# EAGLE schematic Proto2 (EAGLE 8.5.1)
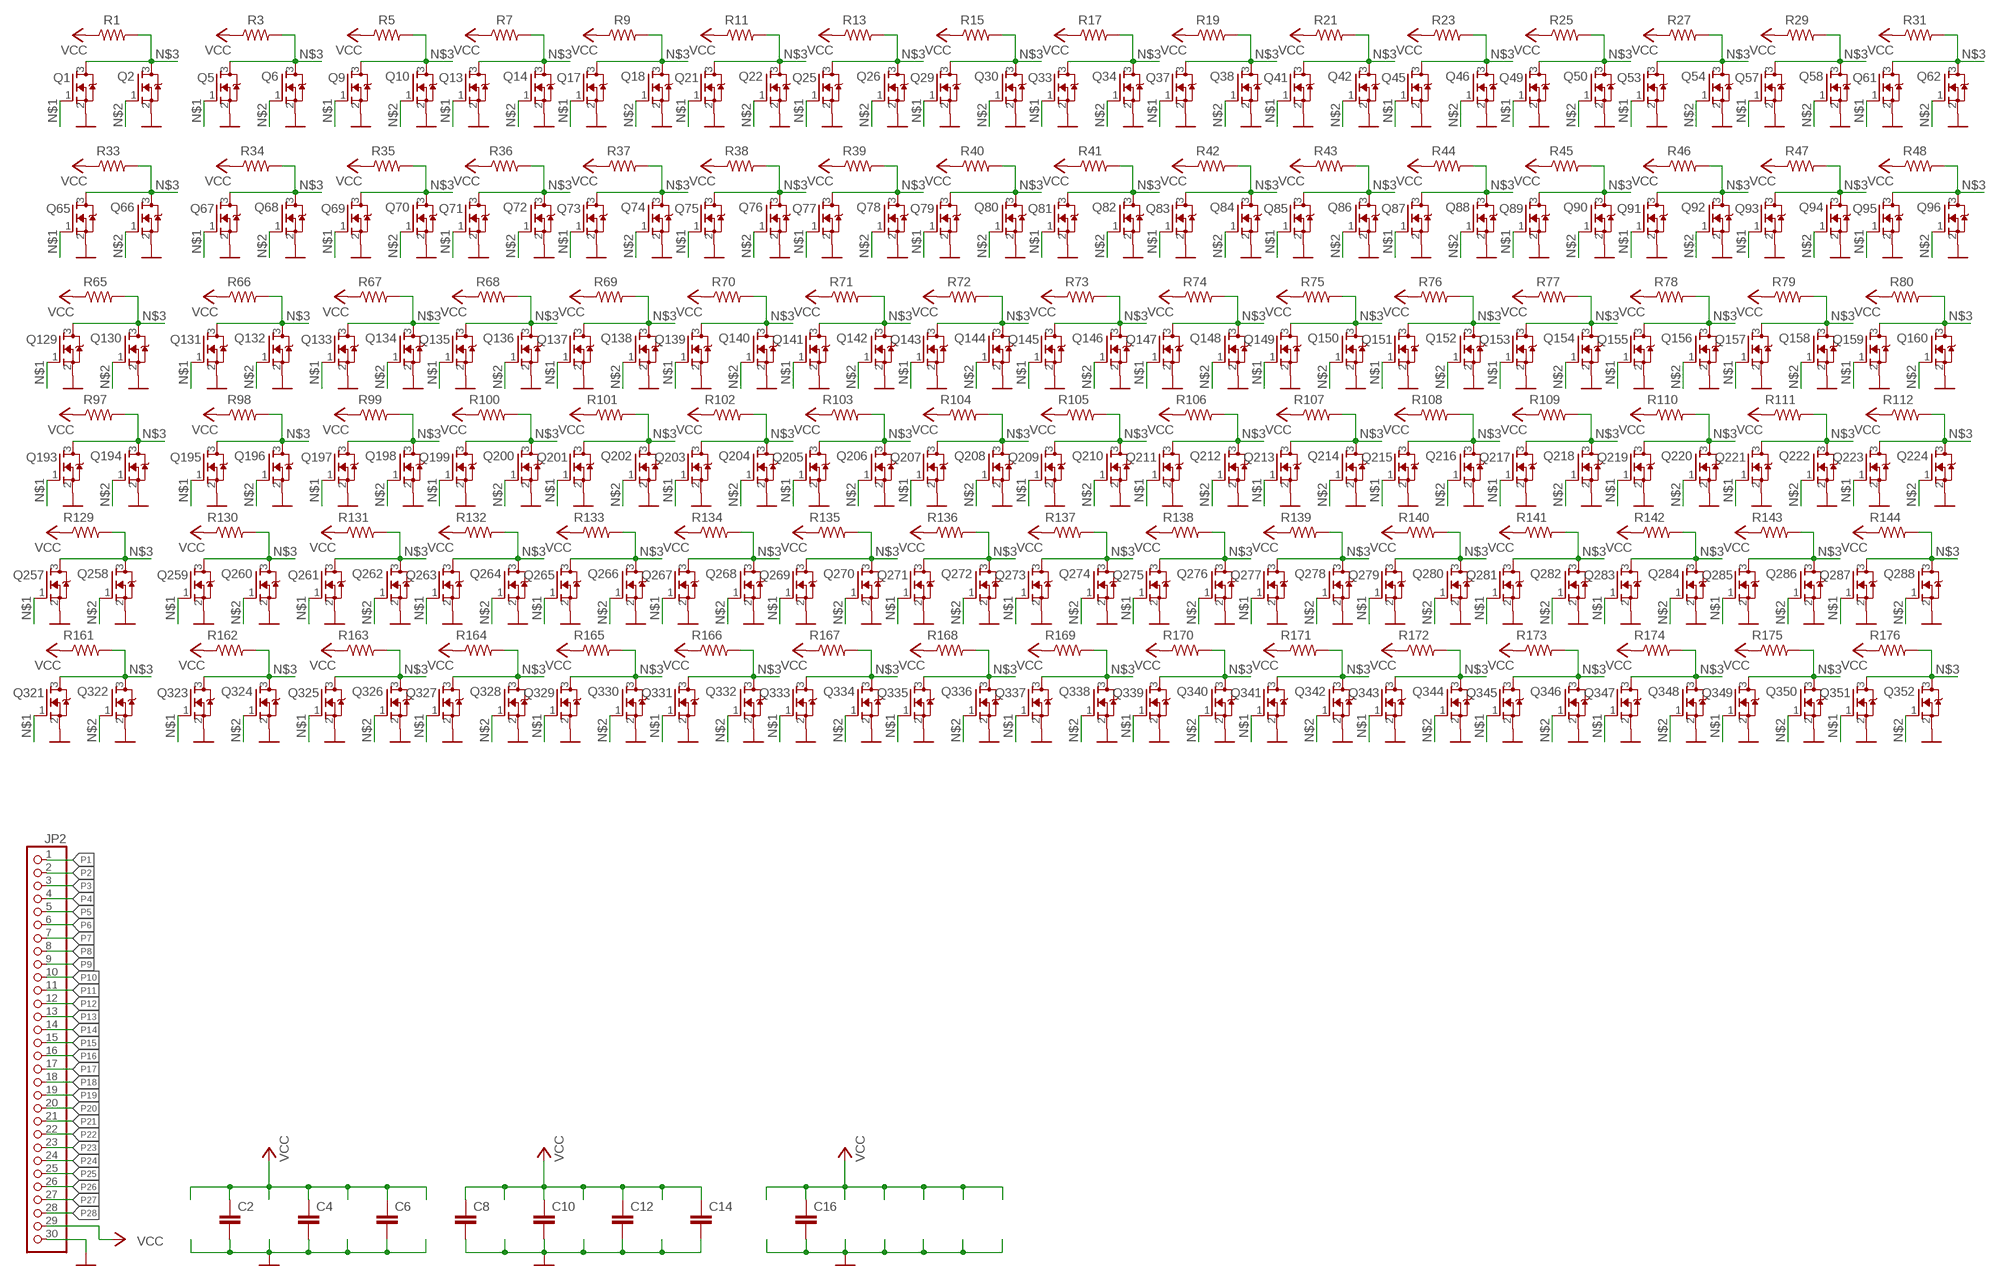
[diagram p0: schematic, sheet 1]

## Parts
C2  C-EUC0805K  [C0805K]
C4  C-EUC0805K  [C0805K]
C6  C-EUC0805K  [C0805K]
C8  C-EUC0805K  [C0805K]
C10  C-EUC0805K  [C0805K]
C12  C-EUC0805K  [C0805K]
C14  C-EUC0805K  [C0805K]
C16  C-EUC0805K  [C0805K]
JP2  PINHD-1X30  [1X30]
Q1  310mA/60V/1.6Ω  NMOSREFLOW  [SOT23]
Q2  310mA/60V/1.6Ω  NMOSREFLOW  [SOT23]
Q5  310mA/60V/1.6Ω  NMOSREFLOW  [SOT23]
Q6  310mA/60V/1.6Ω  NMOSREFLOW  [SOT23]
Q9  310mA/60V/1.6Ω  NMOSREFLOW  [SOT23]
Q10  310mA/60V/1.6Ω  NMOSREFLOW  [SOT23]
Q13  310mA/60V/1.6Ω  NMOSREFLOW  [SOT23]
Q14  310mA/60V/1.6Ω  NMOSREFLOW  [SOT23]
Q17  310mA/60V/1.6Ω  NMOSREFLOW  [SOT23]
Q18  310mA/60V/1.6Ω  NMOSREFLOW  [SOT23]
Q21  310mA/60V/1.6Ω  NMOSREFLOW  [SOT23]
Q22  310mA/60V/1.6Ω  NMOSREFLOW  [SOT23]
Q25  310mA/60V/1.6Ω  NMOSREFLOW  [SOT23]
Q26  310mA/60V/1.6Ω  NMOSREFLOW  [SOT23]
Q29  310mA/60V/1.6Ω  NMOSREFLOW  [SOT23]
Q30  310mA/60V/1.6Ω  NMOSREFLOW  [SOT23]
Q33  310mA/60V/1.6Ω  NMOSREFLOW  [SOT23]
Q34  310mA/60V/1.6Ω  NMOSREFLOW  [SOT23]
Q37  310mA/60V/1.6Ω  NMOSREFLOW  [SOT23]
Q38  310mA/60V/1.6Ω  NMOSREFLOW  [SOT23]
Q41  310mA/60V/1.6Ω  NMOSREFLOW  [SOT23]
Q42  310mA/60V/1.6Ω  NMOSREFLOW  [SOT23]
Q45  310mA/60V/1.6Ω  NMOSREFLOW  [SOT23]
Q46  310mA/60V/1.6Ω  NMOSREFLOW  [SOT23]
Q49  310mA/60V/1.6Ω  NMOSREFLOW  [SOT23]
Q50  310mA/60V/1.6Ω  NMOSREFLOW  [SOT23]
Q53  310mA/60V/1.6Ω  NMOSREFLOW  [SOT23]
Q54  310mA/60V/1.6Ω  NMOSREFLOW  [SOT23]
Q57  310mA/60V/1.6Ω  NMOSREFLOW  [SOT23]
Q58  310mA/60V/1.6Ω  NMOSREFLOW  [SOT23]
Q61  310mA/60V/1.6Ω  NMOSREFLOW  [SOT23]
Q62  310mA/60V/1.6Ω  NMOSREFLOW  [SOT23]
Q65  310mA/60V/1.6Ω  NMOSREFLOW  [SOT23]
Q66  310mA/60V/1.6Ω  NMOSREFLOW  [SOT23]
Q67  310mA/60V/1.6Ω  NMOSREFLOW  [SOT23]
Q68  310mA/60V/1.6Ω  NMOSREFLOW  [SOT23]
Q69  310mA/60V/1.6Ω  NMOSREFLOW  [SOT23]
Q70  310mA/60V/1.6Ω  NMOSREFLOW  [SOT23]
Q71  310mA/60V/1.6Ω  NMOSREFLOW  [SOT23]
Q72  310mA/60V/1.6Ω  NMOSREFLOW  [SOT23]
Q73  310mA/60V/1.6Ω  NMOSREFLOW  [SOT23]
Q74  310mA/60V/1.6Ω  NMOSREFLOW  [SOT23]
Q75  310mA/60V/1.6Ω  NMOSREFLOW  [SOT23]
Q76  310mA/60V/1.6Ω  NMOSREFLOW  [SOT23]
Q77  310mA/60V/1.6Ω  NMOSREFLOW  [SOT23]
Q78  310mA/60V/1.6Ω  NMOSREFLOW  [SOT23]
Q79  310mA/60V/1.6Ω  NMOSREFLOW  [SOT23]
Q80  310mA/60V/1.6Ω  NMOSREFLOW  [SOT23]
Q81  310mA/60V/1.6Ω  NMOSREFLOW  [SOT23]
Q82  310mA/60V/1.6Ω  NMOSREFLOW  [SOT23]
Q83  310mA/60V/1.6Ω  NMOSREFLOW  [SOT23]
Q84  310mA/60V/1.6Ω  NMOSREFLOW  [SOT23]
Q85  310mA/60V/1.6Ω  NMOSREFLOW  [SOT23]
Q86  310mA/60V/1.6Ω  NMOSREFLOW  [SOT23]
Q87  310mA/60V/1.6Ω  NMOSREFLOW  [SOT23]
Q88  310mA/60V/1.6Ω  NMOSREFLOW  [SOT23]
Q89  310mA/60V/1.6Ω  NMOSREFLOW  [SOT23]
Q90  310mA/60V/1.6Ω  NMOSREFLOW  [SOT23]
Q91  310mA/60V/1.6Ω  NMOSREFLOW  [SOT23]
Q92  310mA/60V/1.6Ω  NMOSREFLOW  [SOT23]
Q93  310mA/60V/1.6Ω  NMOSREFLOW  [SOT23]
Q94  310mA/60V/1.6Ω  NMOSREFLOW  [SOT23]
Q95  310mA/60V/1.6Ω  NMOSREFLOW  [SOT23]
Q96  310mA/60V/1.6Ω  NMOSREFLOW  [SOT23]
Q129  310mA/60V/1.6Ω  NMOSREFLOW  [SOT23]
Q130  310mA/60V/1.6Ω  NMOSREFLOW  [SOT23]
Q131  310mA/60V/1.6Ω  NMOSREFLOW  [SOT23]
Q132  310mA/60V/1.6Ω  NMOSREFLOW  [SOT23]
Q133  310mA/60V/1.6Ω  NMOSREFLOW  [SOT23]
Q134  310mA/60V/1.6Ω  NMOSREFLOW  [SOT23]
Q135  310mA/60V/1.6Ω  NMOSREFLOW  [SOT23]
Q136  310mA/60V/1.6Ω  NMOSREFLOW  [SOT23]
Q137  310mA/60V/1.6Ω  NMOSREFLOW  [SOT23]
Q138  310mA/60V/1.6Ω  NMOSREFLOW  [SOT23]
Q139  310mA/60V/1.6Ω  NMOSREFLOW  [SOT23]
Q140  310mA/60V/1.6Ω  NMOSREFLOW  [SOT23]
Q141  310mA/60V/1.6Ω  NMOSREFLOW  [SOT23]
Q142  310mA/60V/1.6Ω  NMOSREFLOW  [SOT23]
Q143  310mA/60V/1.6Ω  NMOSREFLOW  [SOT23]
Q144  310mA/60V/1.6Ω  NMOSREFLOW  [SOT23]
Q145  310mA/60V/1.6Ω  NMOSREFLOW  [SOT23]
Q146  310mA/60V/1.6Ω  NMOSREFLOW  [SOT23]
Q147  310mA/60V/1.6Ω  NMOSREFLOW  [SOT23]
Q148  310mA/60V/1.6Ω  NMOSREFLOW  [SOT23]
Q149  310mA/60V/1.6Ω  NMOSREFLOW  [SOT23]
Q150  310mA/60V/1.6Ω  NMOSREFLOW  [SOT23]
Q151  310mA/60V/1.6Ω  NMOSREFLOW  [SOT23]
Q152  310mA/60V/1.6Ω  NMOSREFLOW  [SOT23]
Q153  310mA/60V/1.6Ω  NMOSREFLOW  [SOT23]
Q154  310mA/60V/1.6Ω  NMOSREFLOW  [SOT23]
Q155  310mA/60V/1.6Ω  NMOSREFLOW  [SOT23]
Q156  310mA/60V/1.6Ω  NMOSREFLOW  [SOT23]
Q157  310mA/60V/1.6Ω  NMOSREFLOW  [SOT23]
Q158  310mA/60V/1.6Ω  NMOSREFLOW  [SOT23]
Q159  310mA/60V/1.6Ω  NMOSREFLOW  [SOT23]
Q160  310mA/60V/1.6Ω  NMOSREFLOW  [SOT23]
Q193  310mA/60V/1.6Ω  NMOSREFLOW  [SOT23]
Q194  310mA/60V/1.6Ω  NMOSREFLOW  [SOT23]
Q195  310mA/60V/1.6Ω  NMOSREFLOW  [SOT23]
Q196  310mA/60V/1.6Ω  NMOSREFLOW  [SOT23]
Q197  310mA/60V/1.6Ω  NMOSREFLOW  [SOT23]
Q198  310mA/60V/1.6Ω  NMOSREFLOW  [SOT23]
Q199  310mA/60V/1.6Ω  NMOSREFLOW  [SOT23]
Q200  310mA/60V/1.6Ω  NMOSREFLOW  [SOT23]
Q201  310mA/60V/1.6Ω  NMOSREFLOW  [SOT23]
Q202  310mA/60V/1.6Ω  NMOSREFLOW  [SOT23]
Q203  310mA/60V/1.6Ω  NMOSREFLOW  [SOT23]
Q204  310mA/60V/1.6Ω  NMOSREFLOW  [SOT23]
Q205  310mA/60V/1.6Ω  NMOSREFLOW  [SOT23]
Q206  310mA/60V/1.6Ω  NMOSREFLOW  [SOT23]
Q207  310mA/60V/1.6Ω  NMOSREFLOW  [SOT23]
Q208  310mA/60V/1.6Ω  NMOSREFLOW  [SOT23]
Q209  310mA/60V/1.6Ω  NMOSREFLOW  [SOT23]
Q210  310mA/60V/1.6Ω  NMOSREFLOW  [SOT23]
Q211  310mA/60V/1.6Ω  NMOSREFLOW  [SOT23]
Q212  310mA/60V/1.6Ω  NMOSREFLOW  [SOT23]
Q213  310mA/60V/1.6Ω  NMOSREFLOW  [SOT23]
Q214  310mA/60V/1.6Ω  NMOSREFLOW  [SOT23]
Q215  310mA/60V/1.6Ω  NMOSREFLOW  [SOT23]
Q216  310mA/60V/1.6Ω  NMOSREFLOW  [SOT23]
Q217  310mA/60V/1.6Ω  NMOSREFLOW  [SOT23]
Q218  310mA/60V/1.6Ω  NMOSREFLOW  [SOT23]
Q219  310mA/60V/1.6Ω  NMOSREFLOW  [SOT23]
Q220  310mA/60V/1.6Ω  NMOSREFLOW  [SOT23]
Q221  310mA/60V/1.6Ω  NMOSREFLOW  [SOT23]
Q222  310mA/60V/1.6Ω  NMOSREFLOW  [SOT23]
Q223  310mA/60V/1.6Ω  NMOSREFLOW  [SOT23]
Q224  310mA/60V/1.6Ω  NMOSREFLOW  [SOT23]
Q257  310mA/60V/1.6Ω  NMOSREFLOW  [SOT23]
Q258  310mA/60V/1.6Ω  NMOSREFLOW  [SOT23]
Q259  310mA/60V/1.6Ω  NMOSREFLOW  [SOT23]
Q260  310mA/60V/1.6Ω  NMOSREFLOW  [SOT23]
Q261  310mA/60V/1.6Ω  NMOSREFLOW  [SOT23]
Q262  310mA/60V/1.6Ω  NMOSREFLOW  [SOT23]
Q263  310mA/60V/1.6Ω  NMOSREFLOW  [SOT23]
Q264  310mA/60V/1.6Ω  NMOSREFLOW  [SOT23]
Q265  310mA/60V/1.6Ω  NMOSREFLOW  [SOT23]
Q266  310mA/60V/1.6Ω  NMOSREFLOW  [SOT23]
Q267  310mA/60V/1.6Ω  NMOSREFLOW  [SOT23]
Q268  310mA/60V/1.6Ω  NMOSREFLOW  [SOT23]
Q269  310mA/60V/1.6Ω  NMOSREFLOW  [SOT23]
Q270  310mA/60V/1.6Ω  NMOSREFLOW  [SOT23]
Q271  310mA/60V/1.6Ω  NMOSREFLOW  [SOT23]
Q272  310mA/60V/1.6Ω  NMOSREFLOW  [SOT23]
Q273  310mA/60V/1.6Ω  NMOSREFLOW  [SOT23]
Q274  310mA/60V/1.6Ω  NMOSREFLOW  [SOT23]
Q275  310mA/60V/1.6Ω  NMOSREFLOW  [SOT23]
Q276  310mA/60V/1.6Ω  NMOSREFLOW  [SOT23]
Q277  310mA/60V/1.6Ω  NMOSREFLOW  [SOT23]
Q278  310mA/60V/1.6Ω  NMOSREFLOW  [SOT23]
Q279  310mA/60V/1.6Ω  NMOSREFLOW  [SOT23]
Q280  310mA/60V/1.6Ω  NMOSREFLOW  [SOT23]
Q281  310mA/60V/1.6Ω  NMOSREFLOW  [SOT23]
Q282  310mA/60V/1.6Ω  NMOSREFLOW  [SOT23]
Q283  310mA/60V/1.6Ω  NMOSREFLOW  [SOT23]
Q284  310mA/60V/1.6Ω  NMOSREFLOW  [SOT23]
Q285  310mA/60V/1.6Ω  NMOSREFLOW  [SOT23]
Q286  310mA/60V/1.6Ω  NMOSREFLOW  [SOT23]
Q287  310mA/60V/1.6Ω  NMOSREFLOW  [SOT23]
Q288  310mA/60V/1.6Ω  NMOSREFLOW  [SOT23]
Q321  310mA/60V/1.6Ω  NMOSREFLOW  [SOT23]
Q322  310mA/60V/1.6Ω  NMOSREFLOW  [SOT23]
Q323  310mA/60V/1.6Ω  NMOSREFLOW  [SOT23]
Q324  310mA/60V/1.6Ω  NMOSREFLOW  [SOT23]
Q325  310mA/60V/1.6Ω  NMOSREFLOW  [SOT23]
Q326  310mA/60V/1.6Ω  NMOSREFLOW  [SOT23]
Q327  310mA/60V/1.6Ω  NMOSREFLOW  [SOT23]
Q328  310mA/60V/1.6Ω  NMOSREFLOW  [SOT23]
Q329  310mA/60V/1.6Ω  NMOSREFLOW  [SOT23]
Q330  310mA/60V/1.6Ω  NMOSREFLOW  [SOT23]
Q331  310mA/60V/1.6Ω  NMOSREFLOW  [SOT23]
Q332  310mA/60V/1.6Ω  NMOSREFLOW  [SOT23]
Q333  310mA/60V/1.6Ω  NMOSREFLOW  [SOT23]
Q334  310mA/60V/1.6Ω  NMOSREFLOW  [SOT23]
Q335  310mA/60V/1.6Ω  NMOSREFLOW  [SOT23]
Q336  310mA/60V/1.6Ω  NMOSREFLOW  [SOT23]
Q337  310mA/60V/1.6Ω  NMOSREFLOW  [SOT23]
Q338  310mA/60V/1.6Ω  NMOSREFLOW  [SOT23]
Q339  310mA/60V/1.6Ω  NMOSREFLOW  [SOT23]
Q340  310mA/60V/1.6Ω  NMOSREFLOW  [SOT23]
Q341  310mA/60V/1.6Ω  NMOSREFLOW  [SOT23]
Q342  310mA/60V/1.6Ω  NMOSREFLOW  [SOT23]
Q343  310mA/60V/1.6Ω  NMOSREFLOW  [SOT23]
Q344  310mA/60V/1.6Ω  NMOSREFLOW  [SOT23]
Q345  310mA/60V/1.6Ω  NMOSREFLOW  [SOT23]
Q346  310mA/60V/1.6Ω  NMOSREFLOW  [SOT23]
Q347  310mA/60V/1.6Ω  NMOSREFLOW  [SOT23]
Q348  310mA/60V/1.6Ω  NMOSREFLOW  [SOT23]
Q349  310mA/60V/1.6Ω  NMOSREFLOW  [SOT23]
Q350  310mA/60V/1.6Ω  NMOSREFLOW  [SOT23]
Q351  310mA/60V/1.6Ω  NMOSREFLOW  [SOT23]
Q352  310mA/60V/1.6Ω  NMOSREFLOW  [SOT23]
R1  RESISTOR0805  [0805]
R3  RESISTOR0805  [0805]
R5  RESISTOR0805  [0805]
R7  RESISTOR0805  [0805]
R9  RESISTOR0805  [0805]
R11  RESISTOR0805  [0805]
R13  RESISTOR0805  [0805]
R15  RESISTOR0805  [0805]
R17  RESISTOR0805  [0805]
R19  RESISTOR0805  [0805]
R21  RESISTOR0805  [0805]
R23  RESISTOR0805  [0805]
R25  RESISTOR0805  [0805]
R27  RESISTOR0805  [0805]
R29  RESISTOR0805  [0805]
R31  RESISTOR0805  [0805]
R33  RESISTOR0805  [0805]
R34  RESISTOR0805  [0805]
R35  RESISTOR0805  [0805]
R36  RESISTOR0805  [0805]
R37  RESISTOR0805  [0805]
R38  RESISTOR0805  [0805]
R39  RESISTOR0805  [0805]
R40  RESISTOR0805  [0805]
R41  RESISTOR0805  [0805]
R42  RESISTOR0805  [0805]
R43  RESISTOR0805  [0805]
R44  RESISTOR0805  [0805]
R45  RESISTOR0805  [0805]
R46  RESISTOR0805  [0805]
R47  RESISTOR0805  [0805]
R48  RESISTOR0805  [0805]
R65  RESISTOR0805  [0805]
R66  RESISTOR0805  [0805]
R67  RESISTOR0805  [0805]
R68  RESISTOR0805  [0805]
R69  RESISTOR0805  [0805]
R70  RESISTOR0805  [0805]
R71  RESISTOR0805  [0805]
R72  RESISTOR0805  [0805]
R73  RESISTOR0805  [0805]
R74  RESISTOR0805  [0805]
R75  RESISTOR0805  [0805]
R76  RESISTOR0805  [0805]
R77  RESISTOR0805  [0805]
R78  RESISTOR0805  [0805]
R79  RESISTOR0805  [0805]
R80  RESISTOR0805  [0805]
R97  RESISTOR0805  [0805]
R98  RESISTOR0805  [0805]
R99  RESISTOR0805  [0805]
R100  RESISTOR0805  [0805]
R101  RESISTOR0805  [0805]
R102  RESISTOR0805  [0805]
R103  RESISTOR0805  [0805]
R104  RESISTOR0805  [0805]
R105  RESISTOR0805  [0805]
R106  RESISTOR0805  [0805]
R107  RESISTOR0805  [0805]
R108  RESISTOR0805  [0805]
R109  RESISTOR0805  [0805]
R110  RESISTOR0805  [0805]
R111  RESISTOR0805  [0805]
R112  RESISTOR0805  [0805]
R129  RESISTOR0805  [0805]
R130  RESISTOR0805  [0805]
R131  RESISTOR0805  [0805]
R132  RESISTOR0805  [0805]
R133  RESISTOR0805  [0805]
R134  RESISTOR0805  [0805]
R135  RESISTOR0805  [0805]
R136  RESISTOR0805  [0805]
R137  RESISTOR0805  [0805]
R138  RESISTOR0805  [0805]
R139  RESISTOR0805  [0805]
R140  RESISTOR0805  [0805]
R141  RESISTOR0805  [0805]
R142  RESISTOR0805  [0805]
R143  RESISTOR0805  [0805]
R144  RESISTOR0805  [0805]
R161  RESISTOR0805  [0805]
R162  RESISTOR0805  [0805]
R163  RESISTOR0805  [0805]
R164  RESISTOR0805  [0805]
R165  RESISTOR0805  [0805]
R166  RESISTOR0805  [0805]
R167  RESISTOR0805  [0805]
R168  RESISTOR0805  [0805]
R169  RESISTOR0805  [0805]
R170  RESISTOR0805  [0805]
R171  RESISTOR0805  [0805]
R172  RESISTOR0805  [0805]
R173  RESISTOR0805  [0805]
R174  RESISTOR0805  [0805]
R175  RESISTOR0805  [0805]
R176  RESISTOR0805  [0805]

## Nets
GND: C2.2 C4.2 C6.2 C8.2 C10.2 C12.2 C14.2 C16.2 JP2.30 Q1.2(S) Q2.2(S) Q5.2(S) Q6.2(S) Q9.2(S) Q10.2(S) Q13.2(S) Q14.2(S) Q17.2(S) Q18.2(S) Q21.2(S) Q22.2(S) Q25.2(S) Q26.2(S) Q29.2(S) Q30.2(S) Q33.2(S) Q34.2(S) Q37.2(S) Q38.2(S) Q41.2(S) Q42.2(S) Q45.2(S) Q46.2(S) Q49.2(S) Q50.2(S) Q53.2(S) Q54.2(S) Q57.2(S) Q58.2(S) Q61.2(S) Q62.2(S) Q65.2(S) Q66.2(S) Q67.2(S) Q68.2(S) Q69.2(S) Q70.2(S) Q71.2(S) Q72.2(S) Q73.2(S) Q74.2(S) Q75.2(S) Q76.2(S) Q77.2(S) Q78.2(S) Q79.2(S) Q80.2(S) Q81.2(S) Q82.2(S) Q83.2(S) Q84.2(S) Q85.2(S) Q86.2(S) Q87.2(S) Q88.2(S) Q89.2(S) Q90.2(S) Q91.2(S) Q92.2(S) Q93.2(S) Q94.2(S) Q95.2(S) Q96.2(S) Q129.2(S) Q130.2(S) Q131.2(S) Q132.2(S) Q133.2(S) Q134.2(S) Q135.2(S) Q136.2(S) Q137.2(S) Q138.2(S) Q139.2(S) Q140.2(S) Q141.2(S) Q142.2(S) Q143.2(S) Q144.2(S) Q145.2(S) Q146.2(S) Q147.2(S) Q148.2(S) Q149.2(S) Q150.2(S) Q151.2(S) Q152.2(S) Q153.2(S) Q154.2(S) Q155.2(S) Q156.2(S) Q157.2(S) Q158.2(S) Q159.2(S) Q160.2(S) Q193.2(S) Q194.2(S) Q195.2(S) Q196.2(S) Q197.2(S) Q198.2(S) Q199.2(S) Q200.2(S) Q201.2(S) Q202.2(S) Q203.2(S) Q204.2(S) Q205.2(S) Q206.2(S) Q207.2(S) Q208.2(S) Q209.2(S) Q210.2(S) Q211.2(S) Q212.2(S) Q213.2(S) Q214.2(S) Q215.2(S) Q216.2(S) Q217.2(S) Q218.2(S) Q219.2(S) Q220.2(S) Q221.2(S) Q222.2(S) Q223.2(S) Q224.2(S) Q257.2(S) Q258.2(S) Q259.2(S) Q260.2(S) Q261.2(S) Q262.2(S) Q263.2(S) Q264.2(S) Q265.2(S) Q266.2(S) Q267.2(S) Q268.2(S) Q269.2(S) Q270.2(S) Q271.2(S) Q272.2(S) Q273.2(S) Q274.2(S) Q275.2(S) Q276.2(S) Q277.2(S) Q278.2(S) Q279.2(S) Q280.2(S) Q281.2(S) Q282.2(S) Q283.2(S) Q284.2(S) Q285.2(S) Q286.2(S) Q287.2(S) Q288.2(S) Q321.2(S) Q322.2(S) Q323.2(S) Q324.2(S) Q325.2(S) Q326.2(S) Q327.2(S) Q328.2(S) Q329.2(S) Q330.2(S) Q331.2(S) Q332.2(S) Q333.2(S) Q334.2(S) Q335.2(S) Q336.2(S) Q337.2(S) Q338.2(S) Q339.2(S) Q340.2(S) Q341.2(S) Q342.2(S) Q343.2(S) Q344.2(S) Q345.2(S) Q346.2(S) Q347.2(S) Q348.2(S) Q349.2(S) Q350.2(S) Q351.2(S) Q352.2(S)
N$1: Q1.1(G) Q5.1(G) Q9.1(G) Q13.1(G) Q17.1(G) Q21.1(G) Q25.1(G) Q29.1(G) Q33.1(G) Q37.1(G) Q41.1(G) Q45.1(G) Q49.1(G) Q53.1(G) Q57.1(G) Q61.1(G) Q65.1(G) Q67.1(G) Q69.1(G) Q71.1(G) Q73.1(G) Q75.1(G) Q77.1(G) Q79.1(G) Q81.1(G) Q83.1(G) Q85.1(G) Q87.1(G) Q89.1(G) Q91.1(G) Q93.1(G) Q95.1(G) Q129.1(G) Q131.1(G) Q133.1(G) Q135.1(G) Q137.1(G) Q139.1(G) Q141.1(G) Q143.1(G) Q145.1(G) Q147.1(G) Q149.1(G) Q151.1(G) Q153.1(G) Q155.1(G) Q157.1(G) Q159.1(G) Q193.1(G) Q195.1(G) Q197.1(G) Q199.1(G) Q201.1(G) Q203.1(G) Q205.1(G) Q207.1(G) Q209.1(G) Q211.1(G) Q213.1(G) Q215.1(G) Q217.1(G) Q219.1(G) Q221.1(G) Q223.1(G) Q257.1(G) Q259.1(G) Q261.1(G) Q263.1(G) Q265.1(G) Q267.1(G) Q269.1(G) Q271.1(G) Q273.1(G) Q275.1(G) Q277.1(G) Q279.1(G) Q281.1(G) Q283.1(G) Q285.1(G) Q287.1(G) Q321.1(G) Q323.1(G) Q325.1(G) Q327.1(G) Q329.1(G) Q331.1(G) Q333.1(G) Q335.1(G) Q337.1(G) Q339.1(G) Q341.1(G) Q343.1(G) Q345.1(G) Q347.1(G) Q349.1(G) Q351.1(G)
N$2: Q2.1(G) Q6.1(G) Q10.1(G) Q14.1(G) Q18.1(G) Q22.1(G) Q26.1(G) Q30.1(G) Q34.1(G) Q38.1(G) Q42.1(G) Q46.1(G) Q50.1(G) Q54.1(G) Q58.1(G) Q62.1(G) Q66.1(G) Q68.1(G) Q70.1(G) Q72.1(G) Q74.1(G) Q76.1(G) Q78.1(G) Q80.1(G) Q82.1(G) Q84.1(G) Q86.1(G) Q88.1(G) Q90.1(G) Q92.1(G) Q94.1(G) Q96.1(G) Q130.1(G) Q132.1(G) Q134.1(G) Q136.1(G) Q138.1(G) Q140.1(G) Q142.1(G) Q144.1(G) Q146.1(G) Q148.1(G) Q150.1(G) Q152.1(G) Q154.1(G) Q156.1(G) Q158.1(G) Q160.1(G) Q194.1(G) Q196.1(G) Q198.1(G) Q200.1(G) Q202.1(G) Q204.1(G) Q206.1(G) Q208.1(G) Q210.1(G) Q212.1(G) Q214.1(G) Q216.1(G) Q218.1(G) Q220.1(G) Q222.1(G) Q224.1(G) Q258.1(G) Q260.1(G) Q262.1(G) Q264.1(G) Q266.1(G) Q268.1(G) Q270.1(G) Q272.1(G) Q274.1(G) Q276.1(G) Q278.1(G) Q280.1(G) Q282.1(G) Q284.1(G) Q286.1(G) Q288.1(G) Q322.1(G) Q324.1(G) Q326.1(G) Q328.1(G) Q330.1(G) Q332.1(G) Q334.1(G) Q336.1(G) Q338.1(G) Q340.1(G) Q342.1(G) Q344.1(G) Q346.1(G) Q348.1(G) Q350.1(G) Q352.1(G)
N$3: Q1.3(D) Q2.3(D) Q5.3(D) Q6.3(D) Q9.3(D) Q10.3(D) Q13.3(D) Q14.3(D) Q17.3(D) Q18.3(D) Q21.3(D) Q22.3(D) Q25.3(D) Q26.3(D) Q29.3(D) Q30.3(D) Q33.3(D) Q34.3(D) Q37.3(D) Q38.3(D) Q41.3(D) Q42.3(D) Q45.3(D) Q46.3(D) Q49.3(D) Q50.3(D) Q53.3(D) Q54.3(D) Q57.3(D) Q58.3(D) Q61.3(D) Q62.3(D) Q65.3(D) Q66.3(D) Q67.3(D) Q68.3(D) Q69.3(D) Q70.3(D) Q71.3(D) Q72.3(D) Q73.3(D) Q74.3(D) Q75.3(D) Q76.3(D) Q77.3(D) Q78.3(D) Q79.3(D) Q80.3(D) Q81.3(D) Q82.3(D) Q83.3(D) Q84.3(D) Q85.3(D) Q86.3(D) Q87.3(D) Q88.3(D) Q89.3(D) Q90.3(D) Q91.3(D) Q92.3(D) Q93.3(D) Q94.3(D) Q95.3(D) Q96.3(D) Q129.3(D) Q130.3(D) Q131.3(D) Q132.3(D) Q133.3(D) Q134.3(D) Q135.3(D) Q136.3(D) Q137.3(D) Q138.3(D) Q139.3(D) Q140.3(D) Q141.3(D) Q142.3(D) Q143.3(D) Q144.3(D) Q145.3(D) Q146.3(D) Q147.3(D) Q148.3(D) Q149.3(D) Q150.3(D) Q151.3(D) Q152.3(D) Q153.3(D) Q154.3(D) Q155.3(D) Q156.3(D) Q157.3(D) Q158.3(D) Q159.3(D) Q160.3(D) Q193.3(D) Q194.3(D) Q195.3(D) Q196.3(D) Q197.3(D) Q198.3(D) Q199.3(D) Q200.3(D) Q201.3(D) Q202.3(D) Q203.3(D) Q204.3(D) Q205.3(D) Q206.3(D) Q207.3(D) Q208.3(D) Q209.3(D) Q210.3(D) Q211.3(D) Q212.3(D) Q213.3(D) Q214.3(D) Q215.3(D) Q216.3(D) Q217.3(D) Q218.3(D) Q219.3(D) Q220.3(D) Q221.3(D) Q222.3(D) Q223.3(D) Q224.3(D) Q257.3(D) Q258.3(D) Q259.3(D) Q260.3(D) Q261.3(D) Q262.3(D) Q263.3(D) Q264.3(D) Q265.3(D) Q266.3(D) Q267.3(D) Q268.3(D) Q269.3(D) Q270.3(D) Q271.3(D) Q272.3(D) Q273.3(D) Q274.3(D) Q275.3(D) Q276.3(D) Q277.3(D) Q278.3(D) Q279.3(D) Q280.3(D) Q281.3(D) Q282.3(D) Q283.3(D) Q284.3(D) Q285.3(D) Q286.3(D) Q287.3(D) Q288.3(D) Q321.3(D) Q322.3(D) Q323.3(D) Q324.3(D) Q325.3(D) Q326.3(D) Q327.3(D) Q328.3(D) Q329.3(D) Q330.3(D) Q331.3(D) Q332.3(D) Q333.3(D) Q334.3(D) Q335.3(D) Q336.3(D) Q337.3(D) Q338.3(D) Q339.3(D) Q340.3(D) Q341.3(D) Q342.3(D) Q343.3(D) Q344.3(D) Q345.3(D) Q346.3(D) Q347.3(D) Q348.3(D) Q349.3(D) Q350.3(D) Q351.3(D) Q352.3(D) R1.2 R3.2 R5.2 R7.2 R9.2 R11.2 R13.2 R15.2 R17.2 R19.2 R21.2 R23.2 R25.2 R27.2 R29.2 R31.2 R33.2 R34.2 R35.2 R36.2 R37.2 R38.2 R39.2 R40.2 R41.2 R42.2 R43.2 R44.2 R45.2 R46.2 R47.2 R48.2 R65.2 R66.2 R67.2 R68.2 R69.2 R70.2 R71.2 R72.2 R73.2 R74.2 R75.2 R76.2 R77.2 R78.2 R79.2 R80.2 R97.2 R98.2 R99.2 R100.2 R101.2 R102.2 R103.2 R104.2 R105.2 R106.2 R107.2 R108.2 R109.2 R110.2 R111.2 R112.2 R129.2 R130.2 R131.2 R132.2 R133.2 R134.2 R135.2 R136.2 R137.2 R138.2 R139.2 R140.2 R141.2 R142.2 R143.2 R144.2 R161.2 R162.2 R163.2 R164.2 R165.2 R166.2 R167.2 R168.2 R169.2 R170.2 R171.2 R172.2 R173.2 R174.2 R175.2 R176.2
P1: JP2.1
P2: JP2.2
P3: JP2.3
P4: JP2.4
P5: JP2.5
P6: JP2.6
P7: JP2.7
P8: JP2.8
P9: JP2.9
P10: JP2.10
P11: JP2.11
P12: JP2.12
P13: JP2.13
P14: JP2.14
P15: JP2.15
P16: JP2.16
P17: JP2.17
P18: JP2.18
P19: JP2.19
P20: JP2.20
P21: JP2.21
P22: JP2.22
P23: JP2.23
P24: JP2.24
P25: JP2.25
P26: JP2.26
P27: JP2.27
P28: JP2.28
VCC: C2.1 C4.1 C6.1 C8.1 C10.1 C12.1 C14.1 C16.1 JP2.29 R1.1 R3.1 R5.1 R7.1 R9.1 R11.1 R13.1 R15.1 R17.1 R19.1 R21.1 R23.1 R25.1 R27.1 R29.1 R31.1 R33.1 R34.1 R35.1 R36.1 R37.1 R38.1 R39.1 R40.1 R41.1 R42.1 R43.1 R44.1 R45.1 R46.1 R47.1 R48.1 R65.1 R66.1 R67.1 R68.1 R69.1 R70.1 R71.1 R72.1 R73.1 R74.1 R75.1 R76.1 R77.1 R78.1 R79.1 R80.1 R97.1 R98.1 R99.1 R100.1 R101.1 R102.1 R103.1 R104.1 R105.1 R106.1 R107.1 R108.1 R109.1 R110.1 R111.1 R112.1 R129.1 R130.1 R131.1 R132.1 R133.1 R134.1 R135.1 R136.1 R137.1 R138.1 R139.1 R140.1 R141.1 R142.1 R143.1 R144.1 R161.1 R162.1 R163.1 R164.1 R165.1 R166.1 R167.1 R168.1 R169.1 R170.1 R171.1 R172.1 R173.1 R174.1 R175.1 R176.1

## Library data of the parts
C2 C4 C6 C8 C10 C12 C14 C16 = rcl:C-EU: CAPACITOR, European symbol; SPICEPREFIX: C
JP2 = XSNOR:PINHD-1X30: PIN HEADER
Q1 Q2 Q5 Q6 Q9 Q10 Q13 Q14 Q17 Q18 Q21 Q22 Q25 Q26 Q29 Q30 Q33 Q34 Q37 Q38 Q41 Q42 Q45 Q46 Q49 Q50 Q53 Q54 Q57 Q58 Q61 Q62 Q65-Q96 Q129-Q160 Q193-Q224 Q257-Q288 Q321-Q352 = XSNOR:NMOS: N-Channel Mosfet 2N7002E - 60V 260mA SOT23 [Digikey: 2N7002ET1GOSTR-ND] - REEL BSH103 - 30V 850mA SOT23 [Digikey: 568-5013-1-ND]
R1 R3 R5 R7 R9 R11 R13 R15 R17 R19 R21 R23 R25 R27 R29 R31 R33-R48 R65-R80 R97-R112 R129-R144 R161-R176 = XSNOR:RESISTOR: Generic Resistor Package

## Net classes
0 default: width 0.2 mm, drill 0.305 mm, clearance 0.2 mm